# EAGLE schematic Traffic Light Controller (EAGLE 9.6.2)
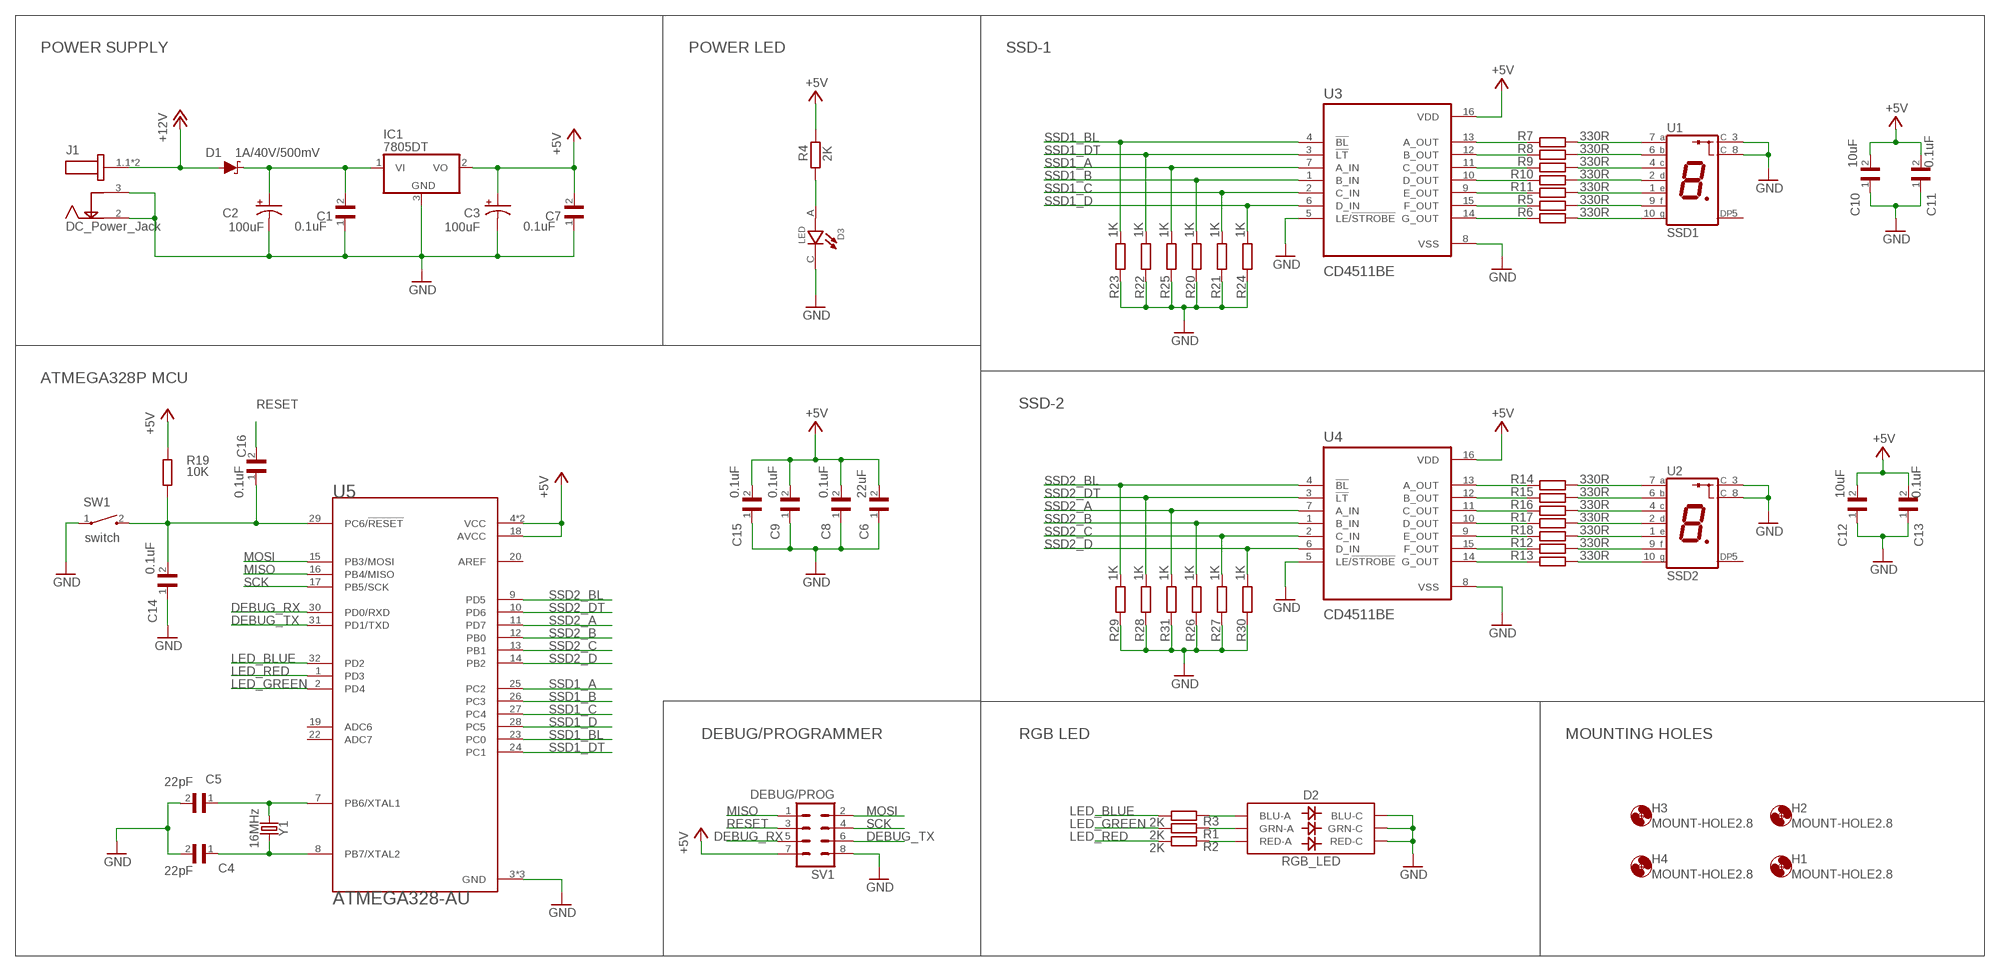
[diagram p0: schematic, sheet 1]

## Parts
C1  0.1uF  CAPACITOR  [C0603]
C2  100uF  100UF-POLAR-RADIAL-2.5MM-25V-20%  [CPOL-RADIAL-2.5MM-6.5MM]
C3  100uF  100UF-POLAR-RADIAL-2.5MM-25V-20%  [CPOL-RADIAL-2.5MM-6.5MM]
C4  22pF  CAPACITOR  [C0603]
C5  22pF  CAPACITOR  [C0603]
C6  22uF  CAPACITOR  [C0603]
C7  0.1uF  CAPACITOR  [C0603]
C8  0.1uF  CAPACITOR  [C0603]
C9  0.1uF  CAPACITOR  [C0603]
C10  10uF  CAPACITOR  [C0603]
C11  0.1uF  CAPACITOR  [C0603]
C12  10uF  CAPACITOR  [C0603]
C13  0.1uF  CAPACITOR  [C0603]
C14  0.1uF  CAPACITOR  [C0603]
C15  0.1uF  CAPACITOR  [C0603]
C16  0.1uF  CAPACITOR  [C0603]
D1  1A/40V/500mV  DIODE-SCHOTTKY-SS14  [SMA-DIODE]
D2  RGB_LED  LED-RGBNO_IC  [LED-TRICOLOR-5050]
D3  LED  LTW-C191TLA  [LEDC1608X65N]
H1  MOUNT-HOLE2.8  [2,8]
H2  MOUNT-HOLE2.8  [2,8]
H3  MOUNT-HOLE2.8  [2,8]
H4  MOUNT-HOLE2.8  [2,8]
IC1  7805DT  [TO252]
J1  DC_Power_Jack  DCJ200-05-A-XX-X_REVA  [GCT_DCJ200-05-A-XX-X_REVA]
R1  2K  RESISTOR  [R0603]
R2  2K  RESISTOR  [R0603]
R3  2K  RESISTOR  [R0603]
R4  2K  RESISTOR  [R0603]
R5  330R  RESISTOR  [R0603]
R6  330R  RESISTOR  [R0603]
R7  330R  RESISTOR  [R0603]
R8  330R  RESISTOR  [R0603]
R9  330R  RESISTOR  [R0603]
R10  330R  RESISTOR  [R0603]
R11  330R  RESISTOR  [R0603]
R12  330R  RESISTOR  [R0603]
R13  330R  RESISTOR  [R0603]
R14  330R  RESISTOR  [R0603]
R15  330R  RESISTOR  [R0603]
R16  330R  RESISTOR  [R0603]
R17  330R  RESISTOR  [R0603]
R18  330R  RESISTOR  [R0603]
R19  10K  RESISTOR  [R0603]
R20  1K  RESISTOR  [R0603]
R21  1K  RESISTOR  [R0603]
R22  1K  RESISTOR  [R0603]
R23  1K  RESISTOR  [R0603]
R24  1K  RESISTOR  [R0603]
R25  1K  RESISTOR  [R0603]
R26  1K  RESISTOR  [R0603]
R27  1K  RESISTOR  [R0603]
R28  1K  RESISTOR  [R0603]
R29  1K  RESISTOR  [R0603]
R30  1K  RESISTOR  [R0603]
R31  1K  RESISTOR  [R0603]
SV1  DEBUG/PROG  MA04-2  [MA04-2]
SW1  switch  1437566-3  [SW_1437566-3]
U1  SSD1  SC52-11HWA  [LED_SC52-11HWA]
U2  SSD2  SC52-11HWA  [LED_SC52-11HWA]
U3  CD4511BE  [DIP794W45P254L1969H508Q16]
U4  CD4511BE  [DIP794W45P254L1969H508Q16]
U5  ATMEGA328-AU  [QFP80P900X900X120-32N]
Y1  16MHz  CRYSTAL-16MHZPTH-HC49US  [HC49US]

## Nets
+5V: C3.1(+) C6.2 C7.2 C8.2 C9.2 C10.2 C11.2 C12.2 C13.2 C15.2 IC1.2(VO) R4.2 R19.2 SV1.7 U3.16(VDD) U4.16(VDD) U5.4(VCC) U5.6(VCC) U5.18(AVCC)
+12V: D1.A J1.1.1 J1.1.2
DEBUG_RX: SV1.5 U5.30(PD0/RXD)
DEBUG_TX: SV1.6 U5.31(PD1/TXD)
GND: C1.1 C2.2(-) C3.2(-) C4.2 C5.2 C6.1 C7.1 C8.1 C9.1 C10.1 C11.1 C12.1 C13.1 C14.1 C15.1 D2.4(BLU-C) D2.5(RED-C) D2.6(GRN-C) D3.C IC1.3(GND) J1.2 J1.3 R20.2 R21.2 R22.2 R23.2 R24.2 R25.2 R26.2 R27.2 R28.2 R29.2 R30.2 R31.2 SV1.8 SW1.1 U1.3(C) U1.8(C) U2.3(C) U2.8(C) U3.5(LE/!STROBE) U3.8(VSS) U4.5(LE/!STROBE) U4.8(VSS) U5.3(GND) U5.5(GND) U5.21(GND)
LED_BLUE: R3.1 U5.32(PD2)
LED_GREEN: R1.1 U5.2(PD4)
LED_RED: R2.1 U5.1(PD3)
MISO: SV1.1 U5.16(PB4/MISO)
MOSI: SV1.2 U5.15(PB3/MOSI)
N$1: C1.2 C2.1(+) D1.C IC1.1(VI)
N$2: D3.A R4.1
N$3: C5.1 U5.7(PB6/XTAL1) Y1.1
N$4: R7.1 U1.7(A)
N$5: C4.1 U5.8(PB7/XTAL2) Y1.2
N$6: C14.2 C16.1 R19.1 SW1.2 U5.29(PC6/!RESET)
N$7: R7.2 U3.13(A_OUT)
N$8: R8.2 U3.12(B_OUT)
N$9: R9.2 U3.11(C_OUT)
N$10: R10.2 U3.10(D_OUT)
N$11: R11.2 U3.9(E_OUT)
N$12: R5.2 U3.15(F_OUT)
N$13: R6.2 U3.14(G_OUT)
N$14: R8.1 U1.6(B)
N$15: R9.1 U1.4(C)
N$16: R10.1 U1.2(D)
N$17: R11.1 U1.1(E)
N$18: R5.1 U1.9(F)
N$19: R6.1 U1.10(G)
N$20: R14.2 U4.13(A_OUT)
N$21: R15.2 U4.12(B_OUT)
N$22: R16.2 U4.11(C_OUT)
N$23: R17.2 U4.10(D_OUT)
N$24: R18.2 U4.9(E_OUT)
N$25: R12.2 U4.15(F_OUT)
N$26: R13.2 U4.14(G_OUT)
N$27: R14.1 U2.7(A)
N$28: R15.1 U2.6(B)
N$29: R16.1 U2.4(C)
N$30: R17.1 U2.2(D)
N$31: R18.1 U2.1(E)
N$32: R12.1 U2.9(F)
N$33: R13.1 U2.10(G)
N$34: D2.3(BLU-A) R3.2
N$35: D2.1(GRN-A) R1.2
N$36: D2.2(RED-A) R2.2
RESET: C16.2 SV1.3
SCK: SV1.4 U5.17(PB5/SCK)
SSD1_A: R25.1 U3.7(A_IN) U5.25(PC2)
SSD1_B: R20.1 U3.1(B_IN) U5.26(PC3)
SSD1_BL: R23.1 U3.4(!BL) U5.23(PC0)
SSD1_C: R21.1 U3.2(C_IN) U5.27(PC4)
SSD1_D: R24.1 U3.6(D_IN) U5.28(PC5)
SSD1_DT: R22.1 U3.3(!LT) U5.24(PC1)
SSD2_A: R31.1 U4.7(A_IN) U5.11(PD7)
SSD2_B: R26.1 U4.1(B_IN) U5.12(PB0)
SSD2_BL: R29.1 U4.4(!BL) U5.9(PD5)
SSD2_C: R27.1 U4.2(C_IN) U5.13(PB1)
SSD2_D: R30.1 U4.6(D_IN) U5.14(PB2)
SSD2_DT: R28.1 U4.3(!LT) U5.10(PD6)
Unconnected: U1.5(DP) U2.5(DP) U5.19(ADC6) U5.20(AREF) U5.22(ADC7)

## Notes on the sheet
- POWER SUPPLY | POWER LED | SSD-1
- ATMEGA328P MCU
- SSD-2
- DEBUG/PROGRAMMER | RGB LED | MOUNTING HOLES

## Library data of the parts
C1 C4-C16 = PC_Capacitor_0603:CAPACITOR: CAP CERAMIC, 0.1UF, 50V, X7R, 0603, FULL REEL Check prices <https://pricing.snapeda.com/parts/CGA3E2X7R1H104K080AA/TDK/view-part?ref=eda>; AVAILABILITY: Good; DESCRIPTION: 0.1µF ±10% 50V Ceramic Capacitor X7R 0603 (1608 Metric); MF: TDK; MP: CGA3E2X7R1H104K080AA; PACKAGE: 1608 TDK; PRICE: None; PURCHASE-URL: https://pricing.snapeda.com/search/part/CGA3E2X7R1H104K080AA/?ref=eda
C2 C3 = SparkFun-Capacitors:100UF-POLAR: 100µF polarized capacitors A capacitor is a passive two-terminal electrical component used to store electrical energy temporarily in an electric field.; PROD_ID: CAP-08439
D1 = SparkFun-DiscreteSemi:DIODE-SCHOTTKY: Schottky diode A Schottky diode is a semiconductor diode which has a low forward voltage drop and a very fast switching action.; PROD_ID: DIO-08053
D2 = SparkFun-LED:LED-RGB: LED-RGB 6 pin RGB LED (no common connector) Packages: PLCC-6 LED-TRICOLOR-5050 - No built-in IC SparkFun Products: Digital Sandbox <https://www.sparkfun.com/products/12651> LED- SMD RGB <https://www.sparkfun.com/products/10866>; PROD_ID: DIO-10298
D3 = PC_LED_0603:LTW-C191TLA: CHIP LED WHITE 0603 TOP VIEW Check prices <https://pricing.snapeda.com/parts/LTW-C191TLA/Lite-On/view-part?ref=eda>; AVAILABILITY: Warning; DESCRIPTION: White LED Indication - Discrete 3.1V 0603 (1608 Metric); MF: Lite-On; MP: LTW-C191TLA; PACKAGE: 0603 Lite-On; PRICE: None; PURCHASE-URL: https://pricing.snapeda.com/search/part/LTW-C191TLA/?ref=eda
H1-H4 = holes:MOUNT-HOLE: MOUNTING HOLE with drill center marker
IC1 = linear 2:78*: Positive VOLTAGE REGULATOR Source: http://cache.national.com/ds/LM/LM78L05.pdf http://www.fairchildsemi.com/ds/LM/LM7805.pdf
J1 = PC_CON_DC_Power_Jack:DCJ200-05-A-XX-X_REVA: DC Power Jack, SMT, Horizontal, with Locating Pegs, D2.0mm Check prices <https://pricing.snapeda.com/parts/DCJ200-05-A-K1-A/Global%20Connector%20Technology/view-part?ref=eda>; AVAILABILITY: Warning; DESCRIPTION: Power Barrel Connector Jack 2.05mm ID (0.081), 5.50mm OD (0.217) Surface Mount, Right Angle; MF: Global Connector Technology; MP: DCJ200-05-A-K1-A; PACKAGE: None; PRICE: None; PURCHASE-URL: https://pricing.snapeda.com/search/part/DCJ200-05-A-K1-A/?ref=eda
R1-R31 = PC_Resistor_0603:RESISTOR; MF: Yageo; RESISTOR: 0603
SV1 = con-lstb:MA04-2: PIN HEADER; OC_FARNELL: unknown; OC_NEWARK: unknown
SW1 = PC_Switch_1437566-3:1437566-3: Switch Tactile OFF (ON) SPST Rectangular Button Gull Wing 0.05A 12VDC SMD Loose Piece Check prices <https://pricing.snapeda.com/parts/1437566-3/TE%20Connectivity/view-part?ref=eda>; AVAILABILITY: Good; COMMENT: 1437566-3; CONFIGURATION_POLE-THROW: Single Pole - Single Throw; CONTACT_CURRENT_RATING: 50 mA; DESCRIPTION: Tactile Switch SPST-NO Top Actuated Surface Mount; MF: TE Connectivity; MP: 1437566-3; PACKAGE: None; PRICE: None
U1 U2 = PC_LED-7-SegmentDisplay:SC52-11HWA: Display: LED; single 7-segment; 13.2mm; red; 0.9-2.2mcd Check availability <https://pricing.snapeda.com/parts/SC52-11HWA/Kingbright/view-part?ref=eda>; AVAILABILITY: Not in stock; DESCRIPTION: Display: LED; single 7-segment; 13.2mm; red; 0.9-2.2mcd; MF: Kingbright; MP: SC52-11HWA; PACKAGE: None; PRICE: None
U3 U4 = PC_IC_CD4511BE:CD4511BE: None Check availability <https://pricing.snapeda.com/parts/CD4511BE/Texas%20Instruments/view-part?ref=eda>; AVAILABILITY: In Stock; DESCRIPTION: CMOS BCD-to-7-Segment LED Latch Decoder Drivers 16-PDIP -55 to 125; MF: Texas Instruments; MP: CD4511BE; PACKAGE: PDIP-16 Texas Instruments; PRICE: None; PURCHASE-URL: https://pricing.snapeda.com/search/part/CD4511BE/?ref=eda
U5 = KC_IC_ATMEGA328-AU:ATMEGA328-AU: ATmega Series 20 MHz 32 KB Flash 2 KB SRAM 8-Bit Microcontroller - TQFP-32 Check prices <https://pricing.snapeda.com/parts/ATMEGA328-AU/Microchip/view-part?ref=eda>; AVAILABILITY: In Stock; DESCRIPTION: AVR AVR® ATmega Microcontroller IC 8-Bit 20MHz 32KB (16K x 16) FLASH 32-TQFP (7x7); MF: Microchip; MP: ATMEGA328-AU; PACKAGE: TQFP-32 Microchip; PRICE: None; PURCHASE-URL: https://pricing.snapeda.com/search/part/ATMEGA328-AU/?ref=eda
Y1 = SparkFun-Clocks:CRYSTAL-16MHZ: 16MHz Crystal Digikey Example <http://www.digikey.com/product-search/en?keywords=535-9122-1-ND> Frequency: 16MHz Frequency Stability: ±50ppm Frequency Tolerance: ±20ppm Load Capacitance: 18pF SparkFun Products: Pro Micro -5V/16MHz <https://www.sparkfun.com/products/12640> SparkFun Serial Enabled LCD Kit <https://www.sparkfun.com/products/10097>; PROD_ID: XTAL-08181; SF_ID: COM-00536